# Altium project Sample_holder_FPC.PrjPcb
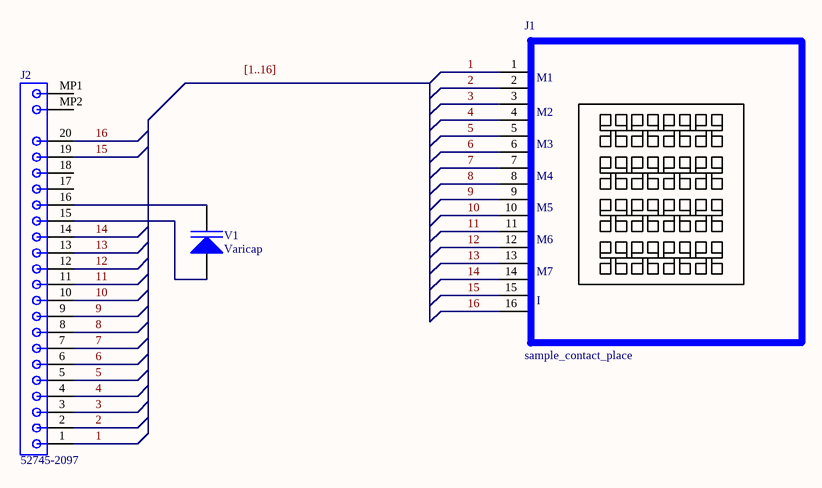
[diagram p0: Schematic_FPC.SchDoc]
1 sheet, 3 parts. Net scope: global (net labels, ports and power ports of the same name join across sheets).
Board file: PCB_FPC.PcbDoc

## Sheet Schematic_FPC.SchDoc
size A4

### Parts
J1  sample_contact_place  [sample]
J2  52745-2097  [MOLX-52745-2097]
V1  Varicap  [DIOC160X80X70L20N]

### Nets
1: J1.1 J2.1
2: J1.2 J2.2
3: J1.3 J2.3
4: J1.4 J2.4
5: J1.5 J2.5
6: J1.6 J2.6
7: J1.7 J2.7
8: J1.8 J2.8
9: J1.9 J2.9
10: J1.10 J2.10
11: J1.11 J2.11
12: J1.12 J2.12
13: J1.13 J2.13
14: J1.14 J2.14
15: J1.15 J2.19
16: J1.16 J2.20
NetJ2_15: J2.15 V1.A
NetJ2_16: J2.16 V1.C

Not connected (* = marked no-connect by the designer): J2 17 18 MP1 MP2

### Buses and harness runs
bus [1..16]

### Notes on the sheet
- Labels drawn without touching a wire or pin: [1..16]
- (in symbol sample_contact_place) M1; M2; M3; M4; M5; M6; M7; I

### Library data of the parts
J2 = 52745-2097: 0.5 mm Pitch Easy-On(TM) Type FPC Connector, 2.0 mm Mated Height, Right Angle, ZIF, SMT, Top Contact, 20 Circuits, -20 to 85 degC, ELV and RoHS Compliant, Tape and Reel; Manufacturer: Molex; Durability (mating cycles max): 20; Mated Height: 2.00mm; Material - Metal: Phosphor Bronze; Polarized to PCB: Yes; Voltage (Max): 50V; Entry Angle: 90degrees Angle; PCB Locator: No; Material - Plating Termination: Gold; Current (Max per Contact): 0.5A; Pitch - Mating Interface: 0.50mm; Contact Position: Top; PartNumber: 52745-2097; ComponentLink1Description: Manufacturer URL; ComponentLink2Description: Datasheet; ComponentLink3URL: http://www.molex.com/pdm_docs/sd/527452097_sd.pdf; ComponentLink3Description: Package Specification; ComponentLink1URL: http://www.molex.com/molex/index.jsp; Packing: Tape and Reel; Number of Rows: 1; ComponentLink2URL: http://www.molex.com/webdocs/datasheets/pdf/en-us/0527452097_FFC_FPC_CONNECTORS.pdf; PackageVersion: Rev. C, 07/2010; RoHS: TRUE; Material - Plating Mating: Gold; PCB Retention: Yes; Orientation: Right Angle; Circuits (Loaded): 20; Stackable: No; Mounting Technology: Surface Mount; PackageReference: 52745-2097; PackageDescription: 20-Lead FPC Connector, Pitch 0.5 mm